# EAGLE schematic BEPxx_Vorlage_6panel_Seed_wMilling (EAGLE 6.5.0)
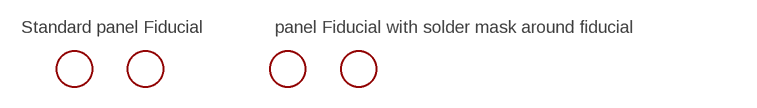
[diagram p0: schematic, sheet 1]

## Parts
FID1  FIDUCIAL  [FIDUCIAL_1MM]
FID1B  FIDUCIALFIDUCIAL_1MM_WITH_SOLDERMASK  [FIDUCIAL_1MM_WITH_SOLDERMASK]
FID2  FIDUCIAL  [FIDUCIAL_1MM]
FID2B  FIDUCIALFIDUCIAL_1MM_WITH_SOLDERMASK  [FIDUCIAL_1MM_WITH_SOLDERMASK]

## Notes on the sheet
- Standard panel Fiducial | panel Fiducial with solder mask around fiducial

## Library data of the parts
FID1 FID1B FID2 FID2B = Fiducial:FIDUCIAL: For use by pick and place machines to calibrate the vision/machine, 1mm By microbuilder.eu